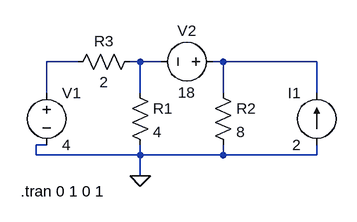
[diagram p0: schematic Circuit_2.asc]
Circuit_2.asc, the LTspice schematic file:
Version 4.1
SHEET 1 880 680
WIRE 96 64 48 64
WIRE 192 64 176 64
WIRE 224 64 192 64
WIRE 320 64 304 64
WIRE 464 64 320 64
WIRE 48 112 48 64
WIRE 192 112 192 64
WIRE 320 112 320 64
WIRE 464 112 464 64
WIRE 48 192 32 192
WIRE 32 208 32 192
WIRE 192 208 192 192
WIRE 192 208 32 208
WIRE 320 208 320 192
WIRE 320 208 192 208
WIRE 464 208 464 192
WIRE 464 208 320 208
WIRE 192 240 192 208
FLAG 192 240 0
SYMBOL voltage 48 96 R0
WINDOW 123 0 0 Left 0
WINDOW 39 0 0 Left 0
SYMATTR InstName V1
SYMATTR Value 4
SYMBOL res 176 96 R0
SYMATTR InstName R1
SYMATTR Value 4
SYMBOL res 304 96 R0
SYMATTR InstName R2
SYMATTR Value 8
SYMBOL res 192 48 R90
WINDOW 0 0 56 VBottom 2
WINDOW 3 32 56 VTop 2
SYMATTR InstName R3
SYMATTR Value 2
SYMBOL current 464 192 R180
WINDOW 0 24 80 Left 2
WINDOW 3 24 0 Left 2
WINDOW 123 0 0 Left 0
WINDOW 39 0 0 Left 0
SYMATTR InstName I1
SYMATTR Value 2
SYMBOL voltage 320 64 R90
WINDOW 0 -32 56 VBottom 2
WINDOW 3 32 56 VTop 2
WINDOW 123 0 0 Left 0
WINDOW 39 0 0 Left 0
SYMATTR InstName V2
SYMATTR Value 18
TEXT 8 264 Left 2 !.tran 0 1 0 1

The netlist it stands for:
* Circuit_2.asc
V1 N001 0 4
R1 N002 0 4
R2 N003 0 8
R3 N002 N001 2
I1 0 N003 2
V2 N003 N002 18
.tran 0 1 0 1
.backanno
.end